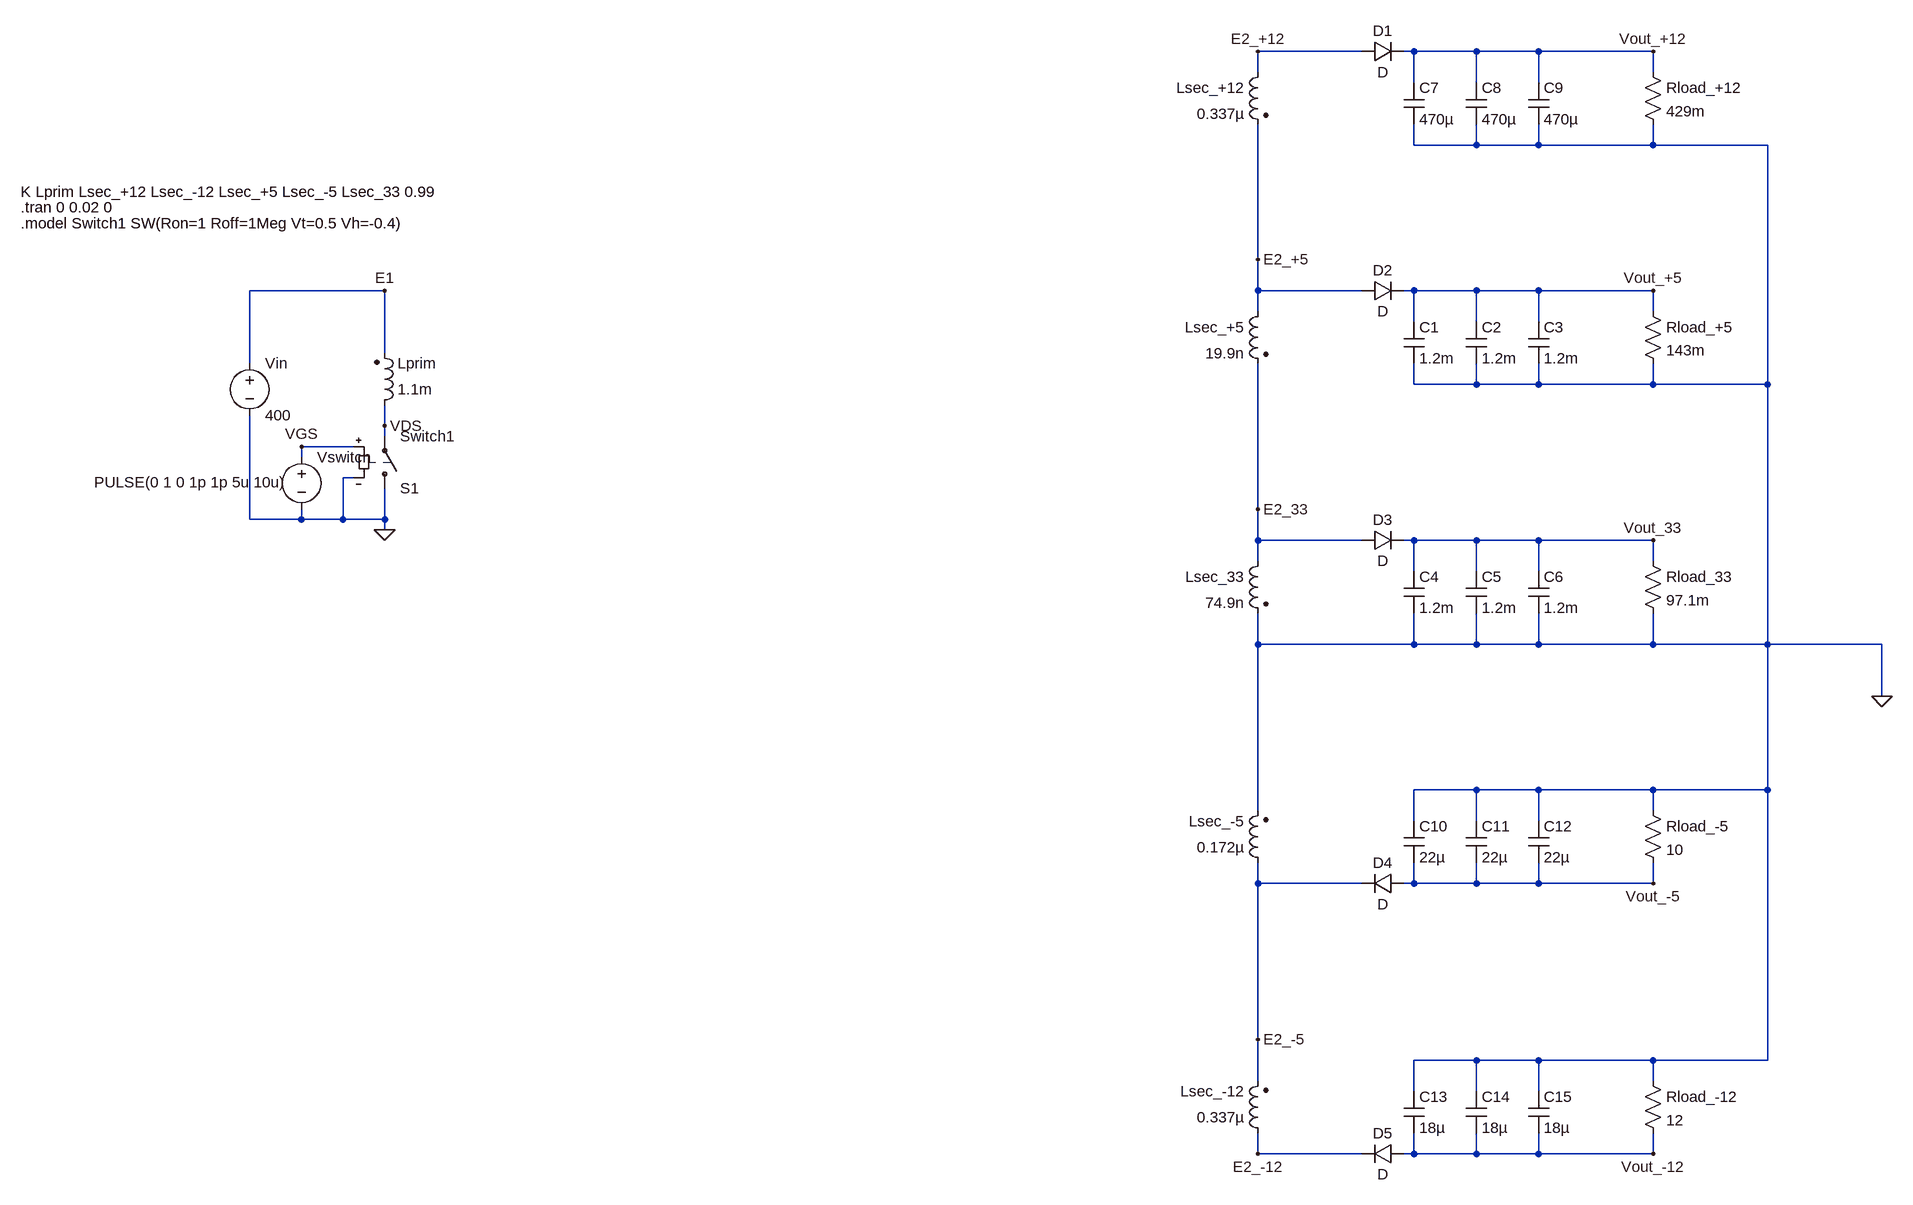
[diagram p0: schematic BasicFlyBack_AllRails_Stacked_Ctrl.asc]
BasicFlyBack_AllRails_Stacked_Ctrl.asc, the LTspice schematic file:
Version 4
SHEET 1 2052 1656
WIRE 1232 -208 1072 -208
WIRE 1312 -208 1296 -208
WIRE 1408 -208 1312 -208
WIRE 1504 -208 1408 -208
WIRE 1680 -208 1504 -208
WIRE 1072 -176 1072 -208
WIRE 1680 -176 1680 -208
WIRE 1312 -160 1312 -208
WIRE 1408 -160 1408 -208
WIRE 1504 -160 1504 -208
WIRE 1312 -64 1312 -96
WIRE 1408 -64 1408 -96
WIRE 1408 -64 1312 -64
WIRE 1504 -64 1504 -96
WIRE 1504 -64 1408 -64
WIRE 1680 -64 1680 -96
WIRE 1680 -64 1504 -64
WIRE 1856 -64 1680 -64
WIRE 1072 112 1072 -96
WIRE -272 160 -480 160
WIRE 1072 160 1072 112
WIRE 1232 160 1072 160
WIRE 1312 160 1296 160
WIRE 1408 160 1312 160
WIRE 1504 160 1408 160
WIRE 1680 160 1504 160
WIRE 1072 192 1072 160
WIRE 1680 192 1680 160
WIRE 1312 208 1312 160
WIRE 1408 208 1408 160
WIRE 1504 208 1504 160
WIRE -272 256 -272 160
WIRE -480 272 -480 160
WIRE 1312 304 1312 272
WIRE 1408 304 1408 272
WIRE 1408 304 1312 304
WIRE 1504 304 1504 272
WIRE 1504 304 1408 304
WIRE 1680 304 1680 272
WIRE 1680 304 1504 304
WIRE 1856 304 1856 -64
WIRE 1856 304 1680 304
WIRE -272 368 -272 336
WIRE -272 384 -272 368
WIRE -320 400 -400 400
WIRE -400 416 -400 400
WIRE -320 448 -336 448
WIRE 1072 496 1072 272
WIRE -480 512 -480 352
WIRE -400 512 -400 496
WIRE -400 512 -480 512
WIRE -336 512 -336 448
WIRE -336 512 -400 512
WIRE -272 512 -272 464
WIRE -272 512 -336 512
WIRE -272 528 -272 512
WIRE 1072 544 1072 496
WIRE 1232 544 1072 544
WIRE 1312 544 1296 544
WIRE 1408 544 1312 544
WIRE 1504 544 1408 544
WIRE 1680 544 1504 544
WIRE 1072 576 1072 544
WIRE 1680 576 1680 544
WIRE 1312 592 1312 544
WIRE 1408 592 1408 544
WIRE 1504 592 1504 544
WIRE 1072 704 1072 656
WIRE 1312 704 1312 656
WIRE 1312 704 1072 704
WIRE 1408 704 1408 656
WIRE 1408 704 1312 704
WIRE 1504 704 1504 656
WIRE 1504 704 1408 704
WIRE 1680 704 1680 656
WIRE 1680 704 1504 704
WIRE 1856 704 1856 304
WIRE 1856 704 1680 704
WIRE 2032 704 1856 704
WIRE 2032 784 2032 704
WIRE 1408 928 1312 928
WIRE 1504 928 1408 928
WIRE 1680 928 1504 928
WIRE 1856 928 1856 704
WIRE 1856 928 1680 928
WIRE 1072 960 1072 704
WIRE 1680 960 1680 928
WIRE 1312 976 1312 928
WIRE 1408 976 1408 928
WIRE 1504 976 1504 928
WIRE 1072 1072 1072 1040
WIRE 1232 1072 1072 1072
WIRE 1312 1072 1312 1040
WIRE 1312 1072 1296 1072
WIRE 1408 1072 1408 1040
WIRE 1408 1072 1312 1072
WIRE 1504 1072 1504 1040
WIRE 1504 1072 1408 1072
WIRE 1680 1072 1680 1040
WIRE 1680 1072 1504 1072
WIRE 1072 1312 1072 1072
WIRE 1408 1344 1312 1344
WIRE 1504 1344 1408 1344
WIRE 1680 1344 1504 1344
WIRE 1856 1344 1856 928
WIRE 1856 1344 1680 1344
WIRE 1072 1376 1072 1312
WIRE 1680 1376 1680 1344
WIRE 1312 1392 1312 1344
WIRE 1408 1392 1408 1344
WIRE 1504 1392 1504 1344
WIRE 1072 1488 1072 1456
WIRE 1232 1488 1072 1488
WIRE 1312 1488 1312 1456
WIRE 1312 1488 1296 1488
WIRE 1408 1488 1408 1456
WIRE 1408 1488 1312 1488
WIRE 1504 1488 1504 1456
WIRE 1504 1488 1408 1488
WIRE 1680 1488 1680 1456
WIRE 1680 1488 1504 1488
FLAG -272 528 0
FLAG -272 160 E1
FLAG 1072 -208 E2_+12
FLAG 1072 112 E2_+5
FLAG 1680 -208 Vout_+12
FLAG 1680 160 Vout_+5
FLAG 1680 544 Vout_33
FLAG -400 400 VGS
FLAG -272 368 VDS
FLAG 1072 1312 E2_-5
FLAG 1680 1072 Vout_-5
FLAG 1072 1488 E2_-12
FLAG 1680 1488 Vout_-12
FLAG 1072 496 E2_33
FLAG 2032 784 0
SYMBOL voltage -480 256 R0
SYMATTR InstName Vin
SYMATTR Value 400
SYMBOL ind2 -288 352 M180
WINDOW 0 36 80 Left 2
WINDOW 3 36 40 Left 2
SYMATTR InstName Lprim
SYMATTR Value 1.1m
SYMATTR Type ind
SYMATTR SpiceLine Rser=1m
SYMBOL ind2 1088 -192 M0
SYMATTR InstName Lsec_+12
SYMATTR Value 0.337µ
SYMATTR Type ind
SYMATTR SpiceLine Rser=1m
SYMBOL ind2 1088 176 M0
SYMATTR InstName Lsec_+5
SYMATTR Value 19.9n
SYMATTR Type ind
SYMATTR SpiceLine Rser=1m
SYMBOL ind2 1088 560 M0
SYMATTR InstName Lsec_33
SYMATTR Value 74.9n
SYMATTR Type ind
SYMATTR SpiceLine Rser=1m
SYMBOL sw -272 480 M180
SYMATTR InstName S1
SYMATTR Value Switch1
SYMBOL voltage -400 400 R0
WINDOW 3 -319 55 Left 2
WINDOW 123 0 0 Left 0
WINDOW 39 0 0 Left 0
SYMATTR Value PULSE(0 1 0 1p 1p 5u 10u)
SYMATTR InstName Vswitch
SYMBOL res 1664 -192 R0
SYMATTR InstName Rload_+12
SYMATTR Value 429m
SYMBOL res 1664 176 R0
SYMATTR InstName Rload_+5
SYMATTR Value 143m
SYMBOL res 1664 560 R0
SYMATTR InstName Rload_33
SYMATTR Value 97.1m
SYMBOL diode 1232 -192 R270
WINDOW 0 32 32 VTop 2
WINDOW 3 0 32 VBottom 2
SYMATTR InstName D1
SYMBOL diode 1232 176 R270
WINDOW 0 32 32 VTop 2
WINDOW 3 0 32 VBottom 2
SYMATTR InstName D2
SYMBOL diode 1232 560 R270
WINDOW 0 32 32 VTop 2
WINDOW 3 0 32 VBottom 2
SYMATTR InstName D3
SYMBOL res 1664 944 R0
SYMATTR InstName Rload_-5
SYMATTR Value 10
SYMBOL diode 1296 1056 R90
WINDOW 0 0 32 VBottom 2
WINDOW 3 32 32 VTop 2
SYMATTR InstName D4
SYMBOL res 1664 1360 R0
SYMATTR InstName Rload_-12
SYMATTR Value 12
SYMBOL diode 1296 1472 R90
WINDOW 0 0 32 VBottom 2
WINDOW 3 32 32 VTop 2
SYMATTR InstName D5
SYMBOL ind2 1088 1056 R180
WINDOW 0 36 80 Left 2
WINDOW 3 36 40 Left 2
SYMATTR InstName Lsec_-5
SYMATTR Value 0.172µ
SYMATTR Type ind
SYMBOL ind2 1088 1472 R180
WINDOW 0 36 80 Left 2
WINDOW 3 36 40 Left 2
SYMATTR InstName Lsec_-12
SYMATTR Value 0.337µ
SYMATTR Type ind
SYMBOL cap 1296 208 R0
SYMATTR InstName C1
SYMATTR Value 1.2m
SYMATTR SpiceLine Rser=50m
SYMBOL cap 1392 208 R0
SYMATTR InstName C2
SYMATTR Value 1.2m
SYMATTR SpiceLine Rser=50m
SYMBOL cap 1488 208 R0
SYMATTR InstName C3
SYMATTR Value 1.2m
SYMATTR SpiceLine Rser=50m
SYMBOL cap 1296 592 R0
SYMATTR InstName C4
SYMATTR Value 1.2m
SYMATTR SpiceLine Rser=50m
SYMBOL cap 1392 592 R0
SYMATTR InstName C5
SYMATTR Value 1.2m
SYMATTR SpiceLine Rser=50m
SYMBOL cap 1488 592 R0
SYMATTR InstName C6
SYMATTR Value 1.2m
SYMATTR SpiceLine Rser=50m
SYMBOL cap 1296 -160 R0
SYMATTR InstName C7
SYMATTR Value 470µ
SYMATTR SpiceLine Rser=160m
SYMBOL cap 1392 -160 R0
SYMATTR InstName C8
SYMATTR Value 470µ
SYMATTR SpiceLine Rser=160m
SYMBOL cap 1488 -160 R0
SYMATTR InstName C9
SYMATTR Value 470µ
SYMATTR SpiceLine Rser=160m
SYMBOL cap 1296 976 R0
SYMATTR InstName C10
SYMATTR Value 22µ
SYMATTR SpiceLine Rser=360m
SYMBOL cap 1392 976 R0
SYMATTR InstName C11
SYMATTR Value 22µ
SYMATTR SpiceLine Rser=360m
SYMBOL cap 1488 976 R0
SYMATTR InstName C12
SYMATTR Value 22µ
SYMATTR SpiceLine Rser=360m
SYMBOL cap 1296 1392 R0
SYMATTR InstName C13
SYMATTR Value 18µ
SYMATTR SpiceLine Rser=1.35
SYMBOL cap 1392 1392 R0
SYMATTR InstName C14
SYMATTR Value 18µ
SYMATTR SpiceLine Rser=1.35
SYMBOL cap 1488 1392 R0
SYMATTR InstName C15
SYMATTR Value 18µ
SYMATTR SpiceLine Rser=1.35
TEXT -832 8 Left 2 !K Lprim Lsec_+12 Lsec_-12 Lsec_+5 Lsec_-5 Lsec_33 0.99
TEXT -832 32 Left 2 !.tran 0 0.02 0
TEXT -832 56 Left 2 !.model Switch1 SW(Ron=1 Roff=1Meg Vt=0.5 Vh=-0.4)

The netlist it stands for:
* BasicFlyBack_AllRails_Stacked_Ctrl.asc
Vin E1 0 400
Lprim VDS E1 1.1m Rser=1m
Lsec_+12 E2_+12 E2_+5 0.337µ Rser=1m
Lsec_+5 E2_+5 E2_33 19.9n Rser=1m
Lsec_33 E2_33 0 74.9n Rser=1m
S1 0 VDS VGS 0 Switch1
Vswitch VGS 0 PULSE(0 1 0 1p 1p 5u 10u)
Rload_+12 Vout_+12 0 429m
Rload_+5 Vout_+5 0 143m
Rload_33 Vout_33 0 97.1m
D1 E2_+12 Vout_+12 D
D2 E2_+5 Vout_+5 D
D3 E2_33 Vout_33 D
Rload_-5 0 Vout_-5 10
D4 Vout_-5 E2_-5 D
Rload_-12 0 Vout_-12 12
D5 Vout_-12 E2_-12 D
Lsec_-5 E2_-5 0 0.172µ
Lsec_-12 E2_-12 E2_-5 0.337µ
C1 Vout_+5 0 1.2m Rser=50m
C2 Vout_+5 0 1.2m Rser=50m
C3 Vout_+5 0 1.2m Rser=50m
C4 Vout_33 0 1.2m Rser=50m
C5 Vout_33 0 1.2m Rser=50m
C6 Vout_33 0 1.2m Rser=50m
C7 Vout_+12 0 470µ Rser=160m
C8 Vout_+12 0 470µ Rser=160m
C9 Vout_+12 0 470µ Rser=160m
C10 0 Vout_-5 22µ Rser=360m
C11 0 Vout_-5 22µ Rser=360m
C12 0 Vout_-5 22µ Rser=360m
C13 0 Vout_-12 18µ Rser=1.35
C14 0 Vout_-12 18µ Rser=1.35
C15 0 Vout_-12 18µ Rser=1.35
.model D D
.lib standard.dio
K Lprim Lsec_+12 Lsec_-12 Lsec_+5 Lsec_-5 Lsec_33 0.99
.tran 0 0.02 0
.model Switch1 SW(Ron=1 Roff=1Meg Vt=0.5 Vh=-0.4)
.backanno
.end